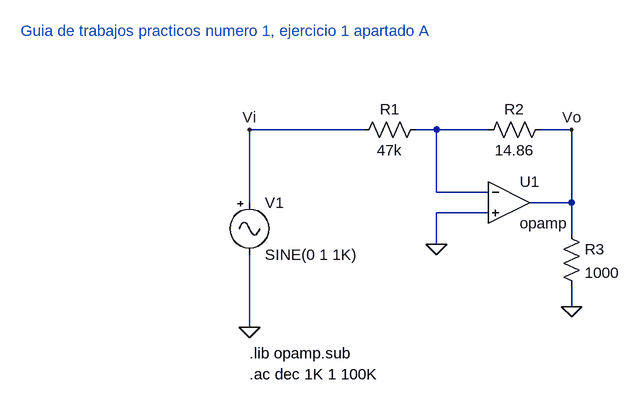
[diagram p0: schematic tp1_1_a.asc]
tp1_1_a.asc, the LTspice schematic file:
Version 4
SHEET 1 880 680
WIRE 192 224 16 224
WIRE 304 224 272 224
WIRE 384 224 304 224
WIRE 512 224 464 224
WIRE 304 320 304 224
WIRE 384 320 304 320
WIRE 16 336 16 224
WIRE 512 336 512 224
WIRE 512 336 448 336
WIRE 384 352 304 352
WIRE 512 384 512 336
WIRE 304 400 304 352
WIRE 512 496 512 464
WIRE 16 528 16 416
FLAG 304 400 0
FLAG 16 528 0
FLAG 512 224 Vo
FLAG 16 224 Vi
FLAG 512 496 0
SYMBOL res 288 208 R90
WINDOW 0 0 56 VBottom 2
WINDOW 3 32 56 VTop 2
SYMATTR InstName R1
SYMATTR Value 47k
SYMBOL res 480 208 R90
WINDOW 0 0 56 VBottom 2
WINDOW 3 32 56 VTop 2
SYMATTR InstName R2
SYMATTR Value 14.86
SYMBOL Opamps/opamp 416 272 R0
SYMATTR InstName U1
SYMBOL Misc/signal 16 320 R0
SYMATTR InstName V1
SYMATTR Value2 AC 1
SYMBOL res 496 368 R0
SYMATTR InstName R3
SYMATTR Value 1000
TEXT 16 568 Left 2 !.lib opamp.sub
TEXT 16 600 Left 2 !.ac dec 1K 1 100K
TEXT -336 72 Left 2 ;Guia de trabajos practicos numero 1, ejercicio 1 apartado A

The netlist it stands for:
* tp1_1_a.asc
R1 N001 Vi 47k
R2 Vo N001 14.86
XU1 N001 0 Vo opamp Aol=100K GBW=10Meg  ; pins invin noninvin out
V1 Vi 0 SINE(0 1 1K) AC 1
R3 Vo 0 1000
.lib opamp.sub
.ac dec 1K 1 100K
* Guia de trabajos practicos numero 1, ejercicio 1 apartado A
.backanno
.end